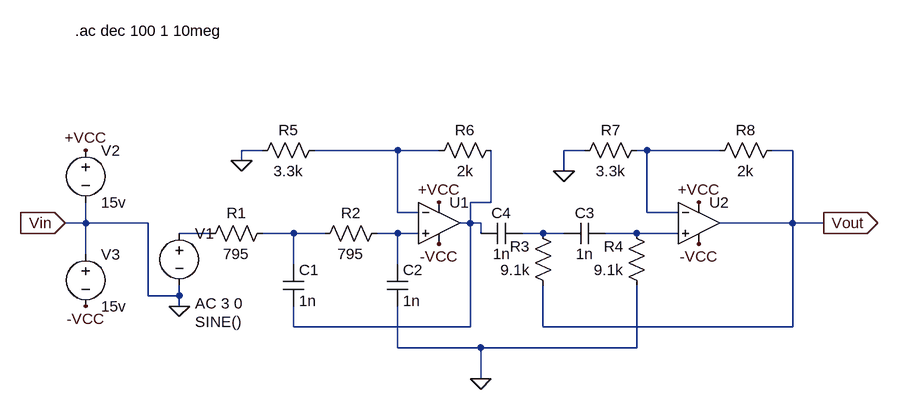
[diagram p0: schematic BPF.asc]
BPF.asc, the LTspice schematic file:
Version 4
SHEET 1 880 680
WIRE -272 32 -304 32
WIRE -64 32 -192 32
WIRE 0 32 -64 32
WIRE 224 32 192 32
WIRE 320 32 304 32
WIRE 432 32 320 32
WIRE 544 32 512 32
WIRE -304 48 -304 32
WIRE 192 64 192 32
WIRE 80 112 80 32
WIRE 80 112 48 112
WIRE -64 128 -64 32
WIRE -32 128 -64 128
WIRE 320 128 320 32
WIRE 368 128 320 128
WIRE -544 144 -544 112
WIRE -544 144 -576 144
WIRE -448 144 -544 144
WIRE 48 144 48 112
WIRE 48 144 32 144
WIRE 64 144 48 144
WIRE 544 144 544 32
WIRE 544 144 432 144
WIRE 592 144 544 144
WIRE -352 160 -400 160
WIRE -224 160 -272 160
WIRE -176 160 -224 160
WIRE -64 160 -96 160
WIRE -32 160 -64 160
WIRE 64 160 64 144
WIRE 160 160 128 160
WIRE 192 160 160 160
WIRE 304 160 256 160
WIRE 368 160 304 160
WIRE -544 192 -544 144
WIRE -224 208 -224 160
WIRE -64 208 -64 160
WIRE -448 256 -448 144
WIRE -400 256 -400 240
WIRE -400 256 -448 256
WIRE -400 272 -400 256
WIRE -224 304 -224 272
WIRE 48 304 48 144
WIRE 48 304 -224 304
WIRE 160 304 160 240
WIRE 544 304 544 144
WIRE 544 304 160 304
WIRE -64 336 -64 272
WIRE 64 336 -64 336
WIRE 304 336 304 240
WIRE 304 336 64 336
WIRE 64 384 64 336
FLAG -304 48 0
FLAG 192 64 0
FLAG 64 384 0
FLAG -400 272 0
FLAG -544 32 +VCC
FLAG -544 272 -VCC
FLAG 0 112 +VCC
FLAG 400 112 +VCC
FLAG 0 176 -VCC
FLAG 400 176 -VCC
FLAG 592 144 Vout
IOPIN 592 144 Out
FLAG -576 144 Vin
IOPIN -576 144 In
SYMBOL res -256 144 R90
WINDOW 0 0 56 VBottom 2
WINDOW 3 32 56 VTop 2
SYMATTR InstName R1
SYMATTR Value 795
SYMBOL res -80 144 R90
WINDOW 0 0 56 VBottom 2
WINDOW 3 32 56 VTop 2
SYMATTR InstName R2
SYMATTR Value 795
SYMBOL res 176 256 R180
WINDOW 0 36 76 Left 2
WINDOW 3 36 40 Left 2
SYMATTR InstName R3
SYMATTR Value 9.1k
SYMBOL res 320 256 R180
WINDOW 0 36 76 Left 2
WINDOW 3 36 40 Left 2
SYMATTR InstName R4
SYMATTR Value 9.1k
SYMBOL cap -240 208 R0
SYMATTR InstName C1
SYMATTR Value 1n
SYMBOL cap -80 208 R0
SYMATTR InstName C2
SYMATTR Value 1n
SYMBOL cap 256 144 R90
WINDOW 0 0 32 VBottom 2
WINDOW 3 32 32 VTop 2
SYMATTR InstName C3
SYMATTR Value 1n
SYMBOL cap 128 144 R90
WINDOW 0 0 32 VBottom 2
WINDOW 3 32 32 VTop 2
SYMATTR InstName C4
SYMATTR Value 1n
SYMBOL res -176 16 R90
WINDOW 0 0 56 VBottom 2
WINDOW 3 32 56 VTop 2
SYMATTR InstName R5
SYMATTR Value 3.3k
SYMBOL res 96 16 R90
WINDOW 0 0 56 VBottom 2
WINDOW 3 32 56 VTop 2
SYMATTR InstName R6
SYMATTR Value 2k
SYMBOL res 320 16 R90
WINDOW 0 0 56 VBottom 2
WINDOW 3 32 56 VTop 2
SYMATTR InstName R7
SYMATTR Value 3.3k
SYMBOL res 528 16 R90
WINDOW 0 0 56 VBottom 2
WINDOW 3 32 56 VTop 2
SYMATTR InstName R8
SYMATTR Value 2k
SYMBOL voltage -400 144 R0
WINDOW 3 24 152 Left 2
WINDOW 123 24 124 Left 2
WINDOW 39 0 0 Left 0
SYMATTR InstName V1
SYMATTR Value SINE()
SYMATTR Value2 AC 3 0
SYMBOL voltage -544 16 R0
WINDOW 123 0 0 Left 0
WINDOW 39 0 0 Left 0
SYMATTR InstName V2
SYMATTR Value 15v
SYMBOL voltage -544 176 R0
WINDOW 123 0 0 Left 0
WINDOW 39 0 0 Left 0
SYMATTR InstName V3
SYMATTR Value 15v
SYMBOL OpAmps\\UniversalOpAmp1 0 144 R0
SYMATTR InstName U1
SYMBOL OpAmps\\UniversalOpAmp1 400 144 R0
SYMATTR InstName U2
TEXT -560 -152 Left 2 !.ac dec 100 1 10meg

The netlist it stands for:
* BPF.asc
R1 N005 N004 795
R2 N006 N005 795
R3 Vout N007 9.1k
R4 0 N008 9.1k
C1 N005 N003 1n
C2 N006 0 1n
C3 N008 N007 1n
C4 N007 N003 1n
R5 N001 0 3.3k
R6 N003 N001 2k
R7 N002 0 3.3k
R8 Vout N002 2k
V1 N004 0 SINE() AC 3 0
V2 +VCC 0 15v
V3 0 -VCC 15v
XU1 N006 N001 +VCC -VCC N003 level1 Avol=1Meg GBW=10Meg Vos=0 En=0 Enk=0 In=0 Ink=0 Rin=500Meg  ; pins In+ In- V+ V- OUT
XU2 N008 N002 +VCC -VCC Vout level1 Avol=1Meg GBW=10Meg Vos=0 En=0 Enk=0 In=0 Ink=0 Rin=500Meg  ; pins In+ In- V+ V- OUT
.ac dec 100 1 10meg
.lib UniversalOpAmp1.lib
.backanno
.end